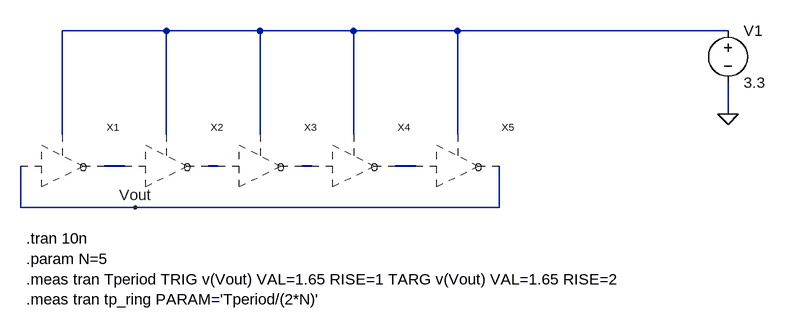
[diagram p0: schematic lab2-task5.asc]
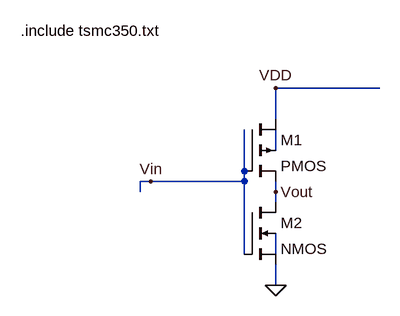
[diagram p1: sub-circuit symb.asc]
lab2-task5.asc, the LTspice schematic file:
Version 4
SHEET 1 1168 680
WIRE 240 112 80 112
WIRE 384 112 240 112
WIRE 528 112 384 112
WIRE 688 112 528 112
WIRE 1104 112 688 112
WIRE 1104 240 1104 192
WIRE 80 272 80 112
WIRE 240 272 240 112
WIRE 384 272 384 112
WIRE 528 272 528 112
WIRE 688 272 688 112
WIRE 176 320 144 320
WIRE 320 320 304 320
WIRE 464 320 448 320
WIRE 624 320 592 320
WIRE 16 384 16 320
WIRE 192 384 16 384
WIRE 752 384 752 320
WIRE 752 384 192 384
FLAG 1104 240 0
FLAG 192 384 Vout
SYMBOL Voltage 1104 96 R0
SYMATTR InstName V1
SYMATTR Value 3.3
SYMBOL symb 80 320 R0
SYMATTR InstName X1
SYMBOL symb 240 320 R0
SYMATTR InstName X2
SYMBOL symb 384 320 R0
SYMATTR InstName X3
SYMBOL symb 528 320 R0
SYMATTR InstName X4
SYMBOL symb 688 320 R0
SYMATTR InstName X5
TEXT 24 432 Left 2 !.tran 10n\n.param N=5             \n.meas tran Tperiod TRIG v(Vout) VAL=1.65 RISE=1 TARG v(Vout) VAL=1.65 RISE=2\n.meas tran tp_ring PARAM='Tperiod/(2*N)'

symb.asc, the sub-circuit schematic file:
Version 4
SHEET 1 880 680
WIRE 560 176 400 176
WIRE 400 224 400 176
WIRE 400 272 400 240
WIRE 352 304 352 240
WIRE 208 320 192 320
WIRE 352 320 352 304
WIRE 352 320 208 320
WIRE 192 336 192 320
WIRE 400 336 400 320
WIRE 400 352 400 336
WIRE 352 432 352 320
WIRE 400 432 400 400
WIRE 400 480 400 448
FLAG 400 480 0
FLAG 208 320 Vin
FLAG 400 176 VDD
FLAG 400 336 Vout
SYMBOL pmos4 352 224 R0
SYMATTR InstName M1
SYMATTR Value2 l=350n w=2u
SYMBOL nmos4 352 352 R0
SYMATTR InstName M2
SYMATTR Value2 l=350n w=1u
TEXT 8 88 Left 2 !.include tsmc350.txt

The netlist it stands for:
* lab2-task5.asc
V1 N001 0 3.3
XX1 Vout N001 N002 symb
XX2 N002 N001 N003 symb
XX3 N003 N001 N004 symb
XX4 N004 N001 N005 symb
XX5 N005 N001 Vout symb

* block symbol definitions
.subckt symb Vin VDD Vout
M1 VDD Vin Vout N001 PMOS l=350n w=2u
M2 Vout Vin 0 N002 NMOS l=350n w=1u
.include tsmc350.txt
.ends symb

.model NMOS NMOS
.model PMOS PMOS
.lib standard.mos
.tran 10n
.param N=5
.meas tran Tperiod TRIG v(Vout) VAL=1.65 RISE=1 TARG v(Vout) VAL=1.65 RISE=2
.meas tran tp_ring PARAM='Tperiod/(2*N)'
.backanno
.end